# Altium schematic sheet Connectors.SchDoc
size A4
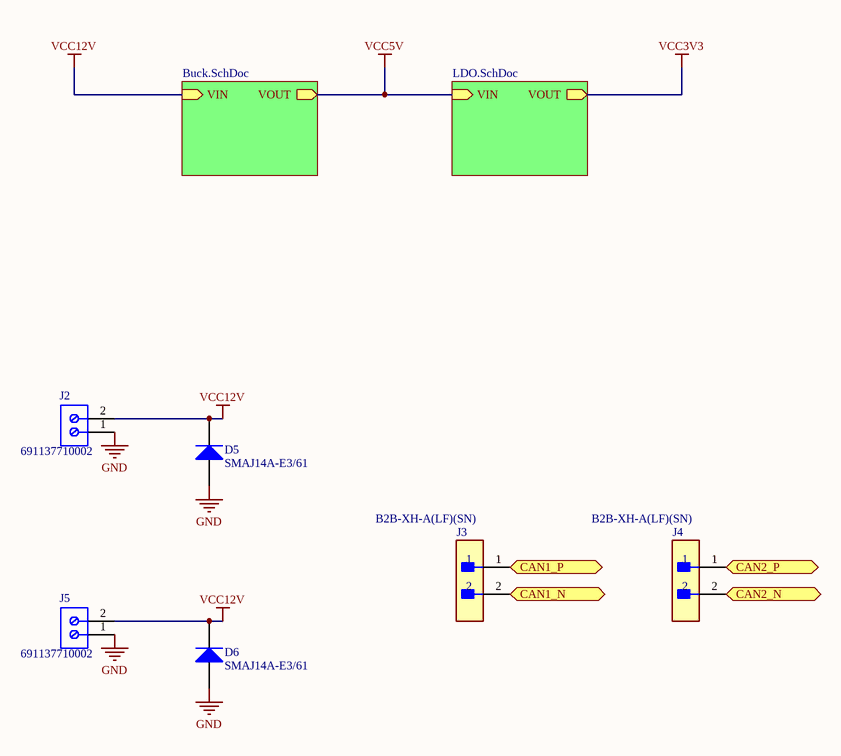
[diagram p0: Connectors.SchDoc]

## Parts
D5  SMAJ14A-E3/61  [VISH-DO-214AC-2_L]
D6  SMAJ14A-E3/61  [VISH-DO-214AC-2_L]
J2  691137710002  [691137710002]
J3  B2B-XH-A(LF)(SN)  [FP-B2B-XH-A_LF_SN-MFG]
J4  B2B-XH-A(LF)(SN)  [FP-B2B-XH-A_LF_SN-MFG]
J5  691137710002  [691137710002]

## Sub-sheets
Buck = Buck.SchDoc: VIN (in), VOUT (out)
LDO = LDO.SchDoc: VIN (in), VOUT (out)

## Ports
CAN1_N (bidir), CAN1_P (bidir), CAN2_N (bidir), CAN2_P (bidir)

## Nets
GND: D5.2(A) D6.2(A) J2.1 J5.1
VCC3V3: sheet LDO/VOUT
VCC5V: sheet Buck/VOUT, sheet LDO/VIN
VCC12V: D5.1(K) D6.1(K) J2.2 J5.2 ; sheet Buck/VIN
CAN1_N: J3.2 ; port CAN1_N
CAN1_P: J3.1 ; port CAN1_P
CAN2_N: J4.2 ; port CAN2_N
CAN2_P: J4.1 ; port CAN2_P

## Library data of the parts
D5 D6 = CMP-0548-00224-2: Transient Voltage Suppressor, 6.40 to 231 V, 14 V Stand-off Voltage, Uni-Directional, -55 to 155 degC, 2-pin DO-214AC, Pb-Free, Tape and Reel; Manufacturer: Vishay Semiconductor; PPPM (W): 400, 300; VWM (V): 14; VBR Uni-Directional (V): 6.4 to 231; IFSM: 40 A; ID (uA): 1; PackageDescription: 2-Pin DO-214AC (SMA), Body 4.245 x 2.665 mm; ComponentLink2URL: http://www.vishay.com/docs/88390/smaj50a.pdf; Mounting Technology: Surface Mount; PartNumber: SMAJ14A-E3/61; Operating Junction and Storage Temperature Range: -55 to 150 degC; ComponentLink2Description: Datasheet; Packing: Tape and Reel; PackageReference: DO-214AC-2; ComponentLink3Description: Package Specification; ComponentLink1URL: http://www.vishay.com/; RoHS: TRUE; ComponentLink3URL: http://www.vishay.com/docs/88390/smaj50a.pdf; ComponentLink1Description: Manufacturer URL; DatasheetVersion: 12/8/2013
J2 J5 = CMP-1502-03324-2: NexarPartId: 78871135; Voltage Rating: 300V; Number of Contacts: 2; Current Rating: 16A; Lead Pitch: 5mm; Height: 11.6mm; Packaging: Box; RoHS: Non-Compliant; Contact Material: Nickel, Tin; Max Operating Temperature: 120°C; Number of Pins: 2; Min Operating Temperature: -30°C; Number of Rows: 1
J3 J4 = CMP-2000-05888-3: CONN HEADER VERT 2POS 2.5MM; Current Rating: 3A; Voltage Rating: 250V; Number of Contacts: 2; Contact Resistance: 20mR; Wire/Cable Gauge: 22AWG; Insulation Resistance: 1GR; Connector Type: Male Pin; Packaging: Bulk; Contact Material: Brass; Lead Free: Lead Free; Orientation: Straight; Contact Plating: Tin; Max Current Rating: 3A; Termination: Solder; Fastening Type: Detent; Depth: 5.75mm; Housing Material: Polyamide; REACH SVHC: No SVHC; Series: XH; Voltage Rating (AC): 250V; Number of Positions: 2; Color: Natural; Contact Type: Male Pin; Max Voltage Rating (DC): 250V; Pitch: 2.5mm; Lead Pitch: 2.5mm; Mount: Through Hole; Max Operating Temperature: 85°C; Length: 7.4mm; Max Voltage Rating (AC): 250V; Min Operating Temperature: -25°C; Number of Rows: 1; Housing Color: White